# Altium schematic sheet OutputLowpas.SchDoc
size A4
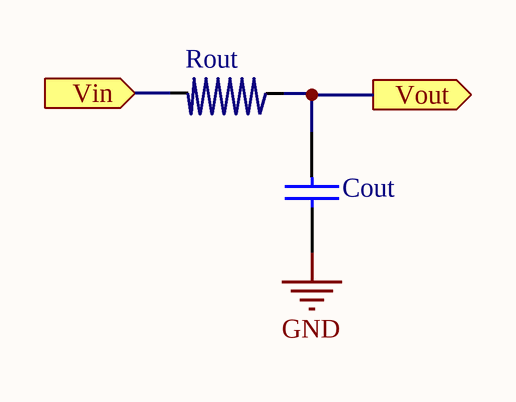
[diagram p0: OutputLowpas.SchDoc]

## Parts
Cout  (no value)  [0805]
Rout  (no value)  [PCBComponent_1]

## Ports
Vin (in), Vout (out)

## Nets
GND: Cout.2
Vin: Rout.1 ; port Vin
Vout: Cout.1 Rout.2 ; port Vout

## Library data of the parts
Cout = CAP
Rout = SPres